# EAGLE design Pop-Up 5.1 (EAGLE 7.2.0)
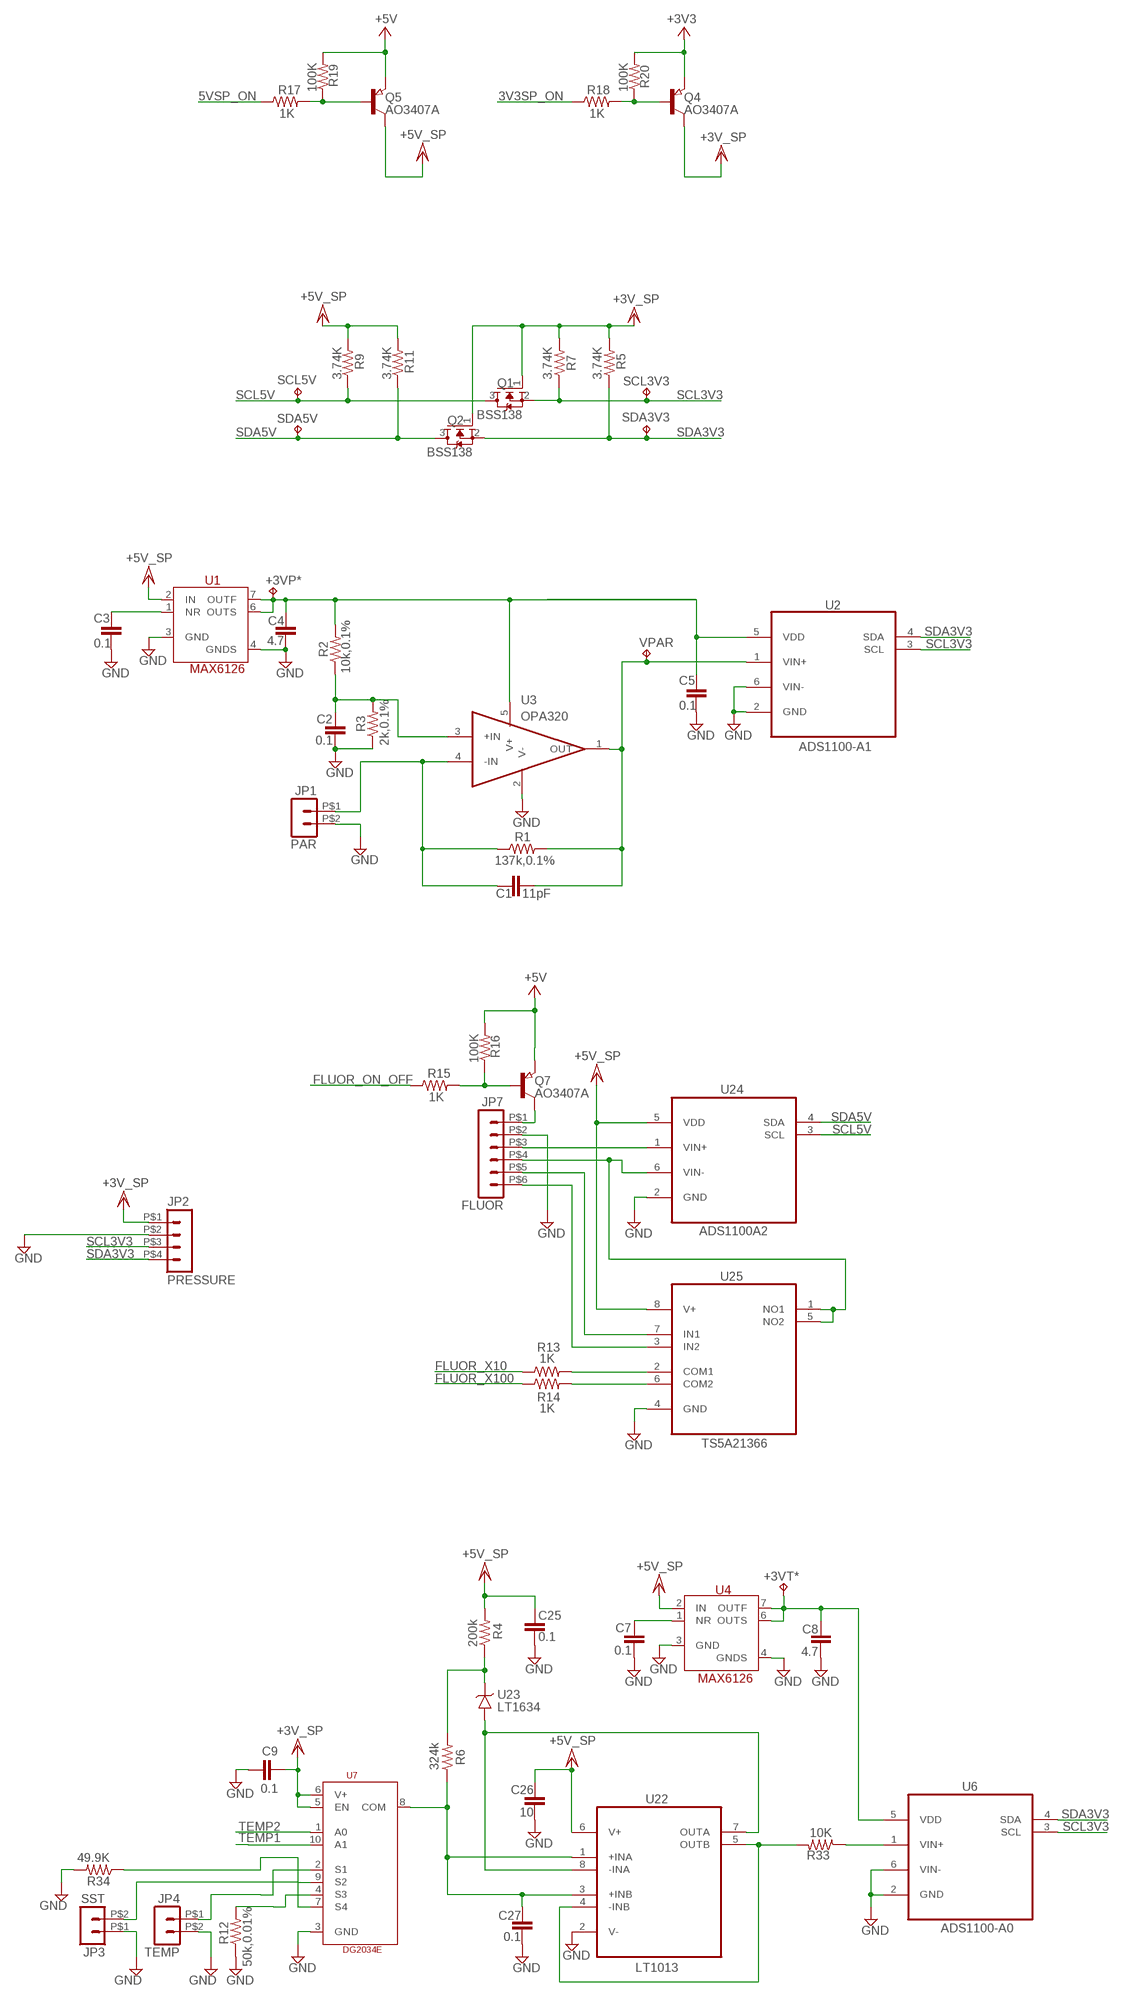
[diagram p0: schematic, sheet 1, part 1 of 2]
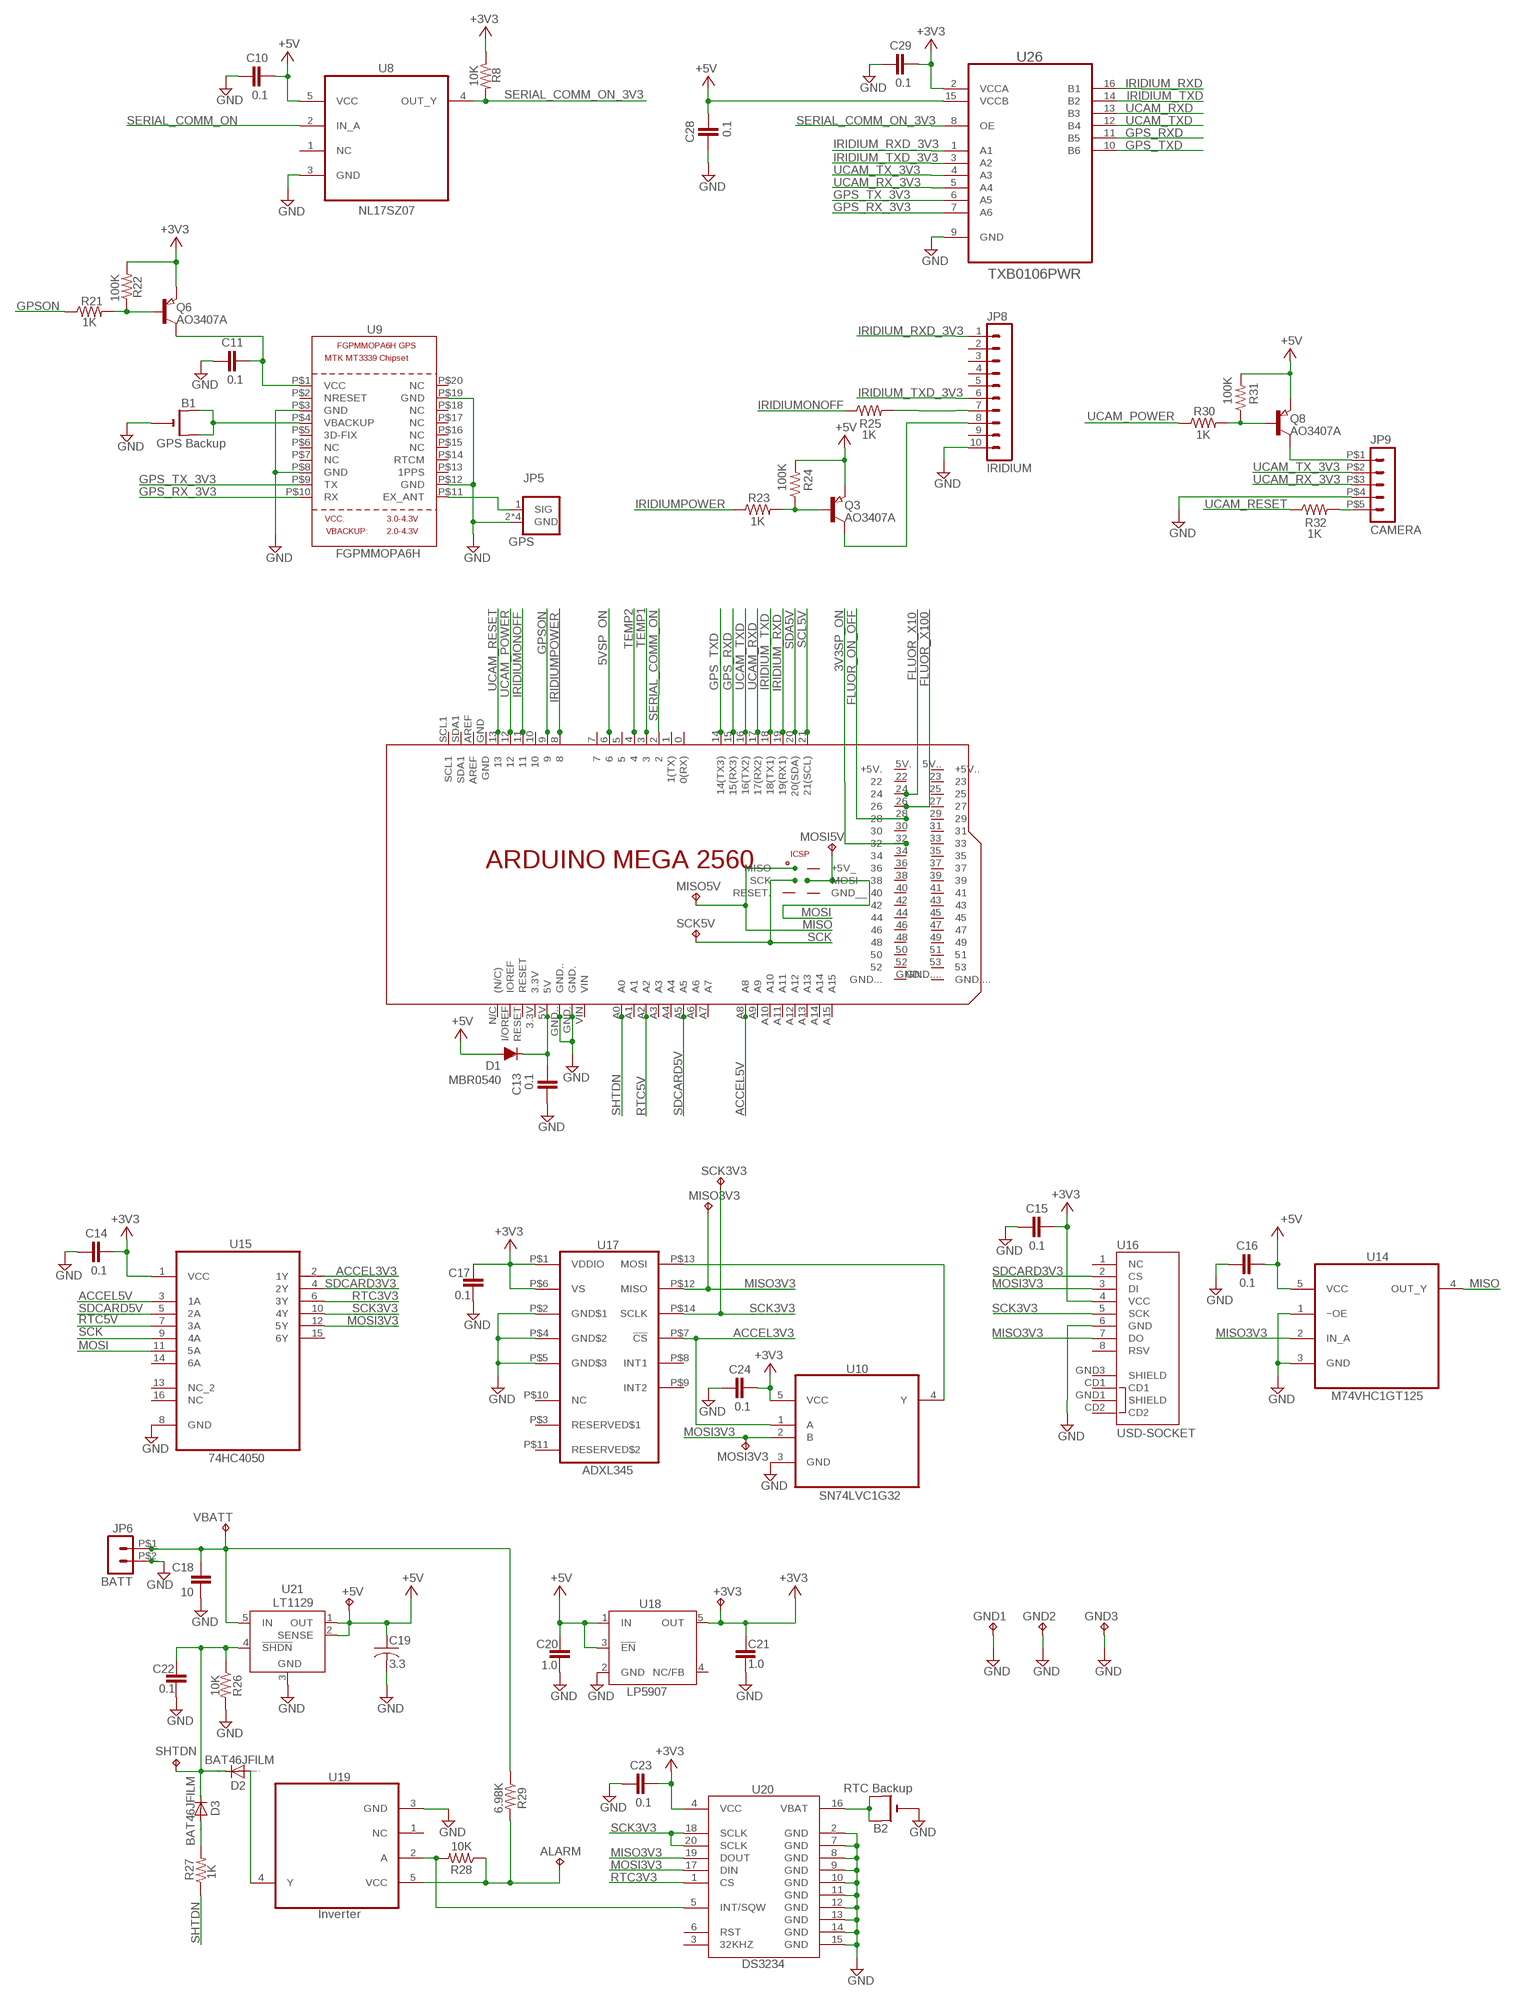
[diagram p1: schematic, sheet 1, part 2 of 2]

## Parts
+3V3  TP-040  [TP-040]
+3VP*  TP-040  [TP-040]
+3VT*  TP-040  [TP-040]
+5V  TP-040  [TP-040]
ALARM  TP-040  [TP-040]
B1  GPS Backup  CR1220SMT  [CR1220-SMD]
B2  RTC Backup  CR1220SMT  [CR1220-SMD]
C1  11pF  CAP0603-CAP  [0603-CAP]
C2  0.1  CAP0603-CAP  [0603-CAP]
C3  0.1  CAP0603-CAP  [0603-CAP]
C4  4.7  CAP0603-CAP  [0603-CAP]
C5  0.1  CAP0603-CAP  [0603-CAP]
C7  0.1  CAP0603-CAP  [0603-CAP]
C8  4.7  CAP0603-CAP  [0603-CAP]
C9  0.1  CAP0603-CAP  [0603-CAP]
C10  0.1  CAP0603-CAP  [0603-CAP]
C11  0.1  CAP0603-CAP  [0603-CAP]
C13  0.1  CAP0603-CAP  [0603-CAP]
C14  0.1  CAP0603-CAP  [0603-CAP]
C15  0.1  CAP0603-CAP  [0603-CAP]
C16  0.1  CAP0603-CAP  [0603-CAP]
C17  0.1  CAP0603-CAP  [0603-CAP]
C18  10  C-EUC1206  [C1206]
C19  3.3  C-USC1206  [C1206]
C20  1.0  CAP0603-CAP  [0603-CAP]
C21  1.0  CAP0603-CAP  [0603-CAP]
C22  0.1  CAP0603-CAP  [0603-CAP]
C23  0.1  CAP0603-CAP  [0603-CAP]
C24  0.1  CAP0603-CAP  [0603-CAP]
C25  0.1  CAP0603-CAP  [0603-CAP]
C26  10  C-EUC1206  [C1206]
C27  0.1  CAP0603-CAP  [0603-CAP]
C28  0.1  CAP0603-CAP  [0603-CAP]
C29  0.1  CAP0603-CAP  [0603-CAP]
D1  MBR0540  D-FILL-SOD123  [SOD123]
D2  BAT46JFILM  DIODE-SOD323-R  [SOD323-R]
D3  BAT46JFILM  DIODE-SOD323-R  [SOD323-R]
GND1  TP-040  [TP-040]
GND2  TP-040  [TP-040]
GND3  TP-040  [TP-040]
JP1  PAR  HEADER_POS2_43650-0215  [43650-0215]
JP2  PRESSURE  HEADER_POS4_43650-0415  [43650-0415]
JP3  SST  HEADER_POS2_43650-0215  [43650-0215]
JP4  TEMP  HEADER_POS2_43650-0215  [43650-0215]
JP5  GPS  901-9895-RFX  [AMPHENOL_901-9895-RFX]
JP6  BATT  HEADER_POS2_43650-0215  [43650-0215]
JP7  FLUOR  HEADER_POS6_43045-0612  [43045-0612]
JP8  IRIDIUM  53398-1010  [53398-1010]
JP9  CAMERA  HEADER_POS5_43650-0515  [43650-0515]
MISO3V3  TP-040  [TP-040]
MISO5V  TP-040  [TP-040]
MOSI3V3  TP-040  [TP-040]
MOSI5V  TP-040  [TP-040]
Q1  BSS138  MOSFET-NREFLOW  [SOT23]
Q2  BSS138  MOSFET-NREFLOW  [SOT23]
Q3  AO3407A  PNP-TRANSISTOR_SOT23  [SOT23]
Q4  AO3407A  PNP-TRANSISTOR_SOT23  [SOT23]
Q5  AO3407A  PNP-TRANSISTOR_SOT23  [SOT23]
Q6  AO3407A  PNP-TRANSISTOR_SOT23  [SOT23]
Q7  AO3407A  PNP-TRANSISTOR_SOT23  [SOT23]
Q8  AO3407A  PNP-TRANSISTOR_SOT23  [SOT23]
R1  137k,0.1%  R-US_R0603  [R0603]
R2  10k,0.1%  R-US_R0603  [R0603]
R3  2k,0.1%  R-US_R0603  [R0603]
R4  200k  R-US_R1206  [R1206]
R5  3.74K  R-US_R0603  [R0603]
R6  324k  R-US_R1206  [R1206]
R7  3.74K  R-US_R0603  [R0603]
R8  10K  R-US_R0603  [R0603]
R9  3.74K  R-US_R0603  [R0603]
R11  3.74K  R-US_R0603  [R0603]
R12  50k,0.01%  R-US_R2010  [R2010]
R13  1K  R-US_R0603  [R0603]
R14  1K  R-US_R0603  [R0603]
R15  1K  R-US_R0603  [R0603]
R16  100K  R-US_R0603  [R0603]
R17  1K  R-US_R0603  [R0603]
R18  1K  R-US_R0603  [R0603]
R19  100K  R-US_R0603  [R0603]
R20  100K  R-US_R0603  [R0603]
R21  1K  R-US_R0603  [R0603]
R22  100K  R-US_R0603  [R0603]
R23  1K  R-US_R0603  [R0603]
R24  100K  R-US_R0603  [R0603]
R25  1K  R-US_R0603  [R0603]
R26  10K  R-US_R0603  [R0603]
R27  1K  R-US_R0603  [R0603]
R28  10K  R-US_R0603  [R0603]
R29  6.98K  R-US_R0603  [R0603]
R30  1K  R-US_R0603  [R0603]
R31  100K  R-US_R0603  [R0603]
R32  1K  R-US_R0603  [R0603]
R33  10K  R-US_R0603  [R0603]
R34  49.9K  R-US_R0603  [R0603]
SCK3V3  TP-040  [TP-040]
SCK5V  TP-040  [TP-040]
SCL3V3  TP-040  [TP-040]
SCL5V  TP-040  [TP-040]
SDA3V3  TP-040  [TP-040]
SDA5V  TP-040  [TP-040]
SHTDN  TP-040  [TP-040]
U1  MAX6126  [SOIC127P600X175-8N]
U2  ADS1100-A1  ADS1100A0IDBVT  [SOT95P280X145-6N]
U3  OPA320  OPA320AIDBVT  [SOT95P280X145-5N]
U4  MAX6126  [SOIC127P600X175-8N]
U6  ADS1100-A0  ADS1100A0IDBVT  [SOT95P280X145-6N]
U7  DG2034E  [MSOP10]
U8  NL17SZ07  NL17SZ07DFT2G  [SOT65P210X110-5N]
U9  FGPMMOPA6H  GPS_FGPMMOPA6H  [FGPMMOPA6H]
U10  SN74LVC1G32  SN74LVC1G32DCKT  [SOT65P210X110-5N]
U12  Arduino MEGA2650  MEGA2650_UPSIDEDOWNMOUNT  [MEGA2650_UPSIDEDOWNMOUNT]
U14  M74VHC1GT125  M74VHC1GT125DF1G  [SOT65P210X110-5N]
U15  74HC4050  M74HC4050RM13TR  [SOIC127P600X175-16N]
U16  USD-SOCKET  [MICROSD_1:1]
U17  ADXL345  [LGA14]
U18  LP5907  TPS77033  [SOT23-DBV]
U19  Inverter  1P1G14MDBVREPG4  [SOT95P280X145-5N]
U20  DS3234  [DS3234]
U21  LT1129  LT1129CQ-5  [Q5-DD]
U22  LT1013  LT1013IS8PBF  [SOIC127P600X175-8N]
U23  LT1634  LT1634BIS8-1.25  [S8]
U24  ADS1100A2  ADS1100A2IDBVT  [SOT95P280X145-6N]
U25  TS5A21366  TS5A21366DCUR  [SOP50P310X90-8N]
U26  TXB0106PWR  [SOP65P640X120-16N]
VBATT  TP-040  [TP-040]
VPAR  TP-040  [TP-040]

## Nets
3V3SP_ON: R18.1 U12.32
5VSP_ON: R17.1 U12.6
+3V3: +3V3.1 C14.1 C15.1 C17.1 C21.1 C23.1 C24.1 C29.1 Q4.2(E) Q6.2(E) R8.1 R20.2 R22.2 U10.5(VCC) U15.1(VCC) U16.4(VCC) U17.P$1(VDDIO) U17.P$6(VS) U18.5(OUT) U20.4(VCC) U26.2(VCCA)
+5V: +5V.1 C10.1 C16.1 C19.1 C20.1 C28.1 D1.2(A) Q3.2(E) Q5.2(E) Q7.2(E) Q8.2(E) R16.2 R19.2 R24.2 R31.2 U8.5(VCC) U14.5(VCC) U18.1(IN) U18.3(!EN) U21.1(OUT) U21.2(SENSE) U26.15(VCCB)
ACCEL3V3: U10.1(A) U15.2(1Y) U17.P$7(!CS)
ACCEL5V: U12.A8 U15.3(1A)
FLUOR_ON_OFF: R15.1 U12.28
FLUOR_X10: R13.1 U12.24
FLUOR_X100: R14.1 U12.26
GND: B1.- B2.- C2.2 C3.2 C4.2 C5.1 C7.2 C8.2 C9.2 C10.2 C11.2 C13.2 C14.2 C15.2 C16.2 C17.2 C18.2 C19.2 C20.2 C21.2 C22.2 C23.2 C24.2 C25.2 C26.2 C27.2 C28.2 C29.2 GND1.1 GND2.1 GND3.1 JP1.P$2 JP2.P$2 JP3.P$1 JP4.P$2 JP5.2(GND) JP5.3(GND) JP5.4(GND) JP5.5(GND) JP6.P$2 JP7.P$2 JP8.10 JP9.P$4 R3.1 R12.1 R26.2 R34.2 U1.3(GND) U1.4(GNDS) U2.2(GND) U2.6(VIN-) U3.2(V-) U4.3(GND) U4.4(GNDS) U6.2(GND) U6.6(VIN-) U7.3(GND) U8.3(GND) U9.P$3(GND) U9.P$8(GND) U9.P$12(GND) U9.P$19(GND) U10.3(GND) U12.GND. U12.GND.. U14.1(~OE) U14.3(GND) U15.8(GND) U16.6(GND) U17.P$2(GND$1) U17.P$4(GND$2) U17.P$5(GND$3) U18.2(GND) U19.3(GND) U20.2(GND) U20.7(GND) U20.8(GND) U20.9(GND) U20.10(GND) U20.11(GND) U20.12(GND) U20.13(GND) U20.14(GND) U20.15(GND) U21.3(GND) U22.2(V-) U24.2(GND) U25.4(GND) U26.9(GND)
GPS_RX_3V3: U9.P$10(RX) U26.7(A6)
GPS_RXD: U12.15(15(RX3)) U26.11(B5)
GPS_TX_3V3: U9.P$9(TX) U26.6(A5)
GPS_TXD: U12.14(14(TX3)) U26.10(B6)
GPSON: R21.1 U12.9
IRIDIUM_RXD: U12.19(19(RX1)) U26.16(B1)
IRIDIUM_RXD_3V3: JP8.1 U26.1(A1)
IRIDIUM_TXD: U12.18(18(TX1)) U26.14(B2)
IRIDIUM_TXD_3V3: JP8.6 U26.3(A2)
IRIDIUMONOFF: R25.1 U12.11
IRIDIUMPOWER: R23.1 U12.8
MISO: MISO5V.1 U12.MISO U14.4(OUT_Y)
MISO3V3: MISO3V3.1 U14.2(IN_A) U16.7(DO) U17.P$12(MISO) U20.19(DOUT)
MOSI: MOSI5V.1 U12.MOSI U15.11(5A)
MOSI3V3: MOSI3V3.1 U10.2(B) U15.12(5Y) U16.3(DI) U20.17(DIN)
N$1: D2.A U19.4(Y)
N$2: Q3.1(B) R23.2 R24.1
N$3: ALARM.1 R28.1 R29.2 U19.5(VCC)
N$4: JP8.7 R25.2
N$5: C7.1 U4.1(NR)
N$6: C13.1 D1.1(C) U12.5V
N$7: JP4.P$1 U7.2(S1)
N$9: JP8.8 Q3.3(C)
N$10: JP5.1(SIG) U9.P$11(EX_ANT)
N$11: +3VT*.1 C8.1 U4.6(OUTS) U4.7(OUTF) U6.5(VDD)
N$12: R4.1 R6.2 U23.6(VOUT)
N$13: U22.7(OUTA) U22.8(-INA) U23.4(GND)
N$14: B1.+$1(+) B1.+$2(+1) U9.P$4(VBACKUP)
N$15: Q6.1(B) R21.2 R22.1
N$16: B2.+$1(+) B2.+$2(+1) U20.16(VBAT)
N$17: R28.2 U19.2(A) U20.5(INT/SQW)
N$18: R33.2 U22.4(-INB) U22.5(OUTB)
N$19: C11.1 Q6.3(C) U9.P$1(VCC)
N$20: JP7.P$3 U24.1(VIN+)
N$21: R13.2 U25.2(COM1)
N$22: JP7.P$5 U25.7(IN1)
N$23: +3VP*.1 C4.1 C5.2 R2.2 U1.6(OUTS) U1.7(OUTF) U2.5(VDD) U3.5(V+)
N$24: C3.1 U1.1(NR)
N$25: C1.2 R1.2 U2.1(VIN+) U3.1(OUT) VPAR.1
N$26: R12.2 U7.4(S3)
N$28: C2.1 R2.1 R3.2 U3.3(+IN)
N$29: JP7.P$6 U25.3(IN2)
N$30: C1.1 JP1.P$1 R1.1 U3.4(-IN)
N$31: C22.1 D2.C D3.C R26.1 SHTDN.1 U21.4(!SHDN)
N$32: Q5.1(B) R17.2 R19.1
N$33: Q4.1(B) R18.2 R20.1
N$34: R14.2 U25.6(COM2)
N$35: U10.4(Y) U17.P$13(MOSI)
N$36: C27.1 R6.1 U7.8(COM) U22.1(+INA) U22.3(+INB)
N$37: Q7.1(B) R15.2 R16.1
N$38: JP7.P$4 U24.6(VIN-) U25.1(NO1) U25.5(NO2)
N$39: Q8.1(B) R30.2 R31.1
N$40: JP7.P$1 Q7.3(C)
N$41: JP9.P$1 Q8.3(C)
N$42: R33.1 U6.1(VIN+)
N$43: JP9.P$5 R32.2
N$44: D3.A R27.2
N$45: JP3.P$2 U7.9(S2)
N$47: R34.1 U7.7(S4)
RTC3V3: U15.6(3Y) U20.1(CS)
RTC5V: U12.A2 U15.7(3A)
SCK: SCK5V.1 U12.SCK U15.9(4A)
SCK3V3: SCK3V3.1 U15.10(4Y) U16.5(SCK) U17.P$14(SCLK) U20.18(SCLK) U20.20(SCLK)
SCL3V3: JP2.P$3 Q1.2(S) R7.1 SCL3V3.1 U2.3(SCL) U6.3(SCL)
SCL5V: Q1.3(D) R9.1 SCL5V.1 U12.21(21(SCL)) U24.3(SCL)
SDA3V3: JP2.P$4 Q2.2(S) R5.1 SDA3V3.1 U2.4(SDA) U6.4(SDA)
SDA5V: Q2.3(D) R11.1 SDA5V.1 U12.20(20(SDA)) U24.4(SDA)
SDCARD3V3: U15.4(2Y) U16.2(CS)
SDCARD5V: U12.A5 U15.5(2A)
SERIAL_COMM_ON: U8.2(IN_A) U12.2
SERIAL_COMM_ON_3V3: R8.2 U8.4(OUT_Y) U26.8(OE)
SHTDN: R27.1 U12.A0
TEMP1: U7.10(A1) U12.3
TEMP2: U7.1(A0) U12.4
UCAM_POWER: R30.1 U12.12
UCAM_RESET: R32.1 U12.13
UCAM_RX_3V3: JP9.P$3 U26.5(A4)
UCAM_RXD: U12.17(17(RX2)) U26.13(B3)
UCAM_TX_3V3: JP9.P$2 U26.4(A3)
UCAM_TXD: U12.16(16(TX2)) U26.12(B4)
VBATT: C18.1 JP6.P$1 R29.1 U21.5(IN) VBATT.1
VCC/2: C25.1 C26.1 Q5.3(C) R4.2 R9.2 R11.2 U1.2(IN) U4.2(IN) U22.6(V+) U24.5(VDD) U25.8(V+) ; supply symbol labelled +5V_SP
VDD: C9.1 JP2.P$1 Q1.1(G) Q2.1(G) Q4.3(C) R5.2 R7.2 U7.5(EN) U7.6(V+) ; supply symbol labelled +3V_SP
Unconnected: JP8.2 JP8.3 JP8.4 JP8.5 JP8.9 U8.1(NC) U9.P$2(NRESET) U9.P$5(3D-FIX) U9.P$6(NC) U9.P$7(NC) U9.P$13(1PPS) U9.P$14(RTCM) U9.P$15(NC) U9.P$16(NC) U9.P$17(NC) U9.P$18(NC) U9.P$20(NC) U12.0(0(RX)) U12.1(1(TX)) U12.3.3V U12.5 U12.5V.(+5V.) U12.5V..(+5V..) U12.7 U12.10 U12.22 U12.23 U12.25 U12.27 U12.29 U12.30 U12.31 U12.33 U12.34 U12.35 U12.36 U12.37 U12.38 U12.39 U12.40 U12.41 U12.42 U12.43 U12.44 U12.45 U12.46 U12.47 U12.48 U12.49 U12.50 U12.51 U12.52 U12.53 U12.+5V_ U12.A1 U12.A3 U12.A4 U12.A6 U12.A7 U12.A9 U12.A10 U12.A11 U12.A12 U12.A13 U12.A14 U12.A15 U12.AREF U12.GND U12.GND... U12.GND.... U12.GND__ U12.I/OREF(IOREF) U12.N/C((N/C)) U12.RESET U12.RESET. U12.SCL1 U12.SDA1 U12.VIN U15.13(NC_2) U15.14(6A) U15.15(6Y) U15.16(NC) U16.1(NC) U16.8(RSV) U16.CD1 U16.CD2 U16.GND1(SHIELD) U16.GND3(SHIELD) U17.P$3(RESERVED$1) U17.P$8(INT1) U17.P$9(INT2) U17.P$10(NC) U17.P$11(RESERVED$2) U18.4(NC/FB) U19.1(NC) U20.3(32KHZ) U20.6(RST)

## Library data of the parts
+3V3 +3VP* +3VT* +5V ALARM GND1-GND3 MISO3V3 MISO5V MOSI3V3 MOSI5V SCK3V3 SCK5V SCL3V3 SCL5V SDA3V3 SDA5V SHTDN VBATT VPAR = keystone:TP: TEST POINT PCB Vertical Mount; OC_NEWARK: unknown
B1 B2 = adafruit:CR1220: CR1216/CR1220/CR1225 12mm 3V lithium coin cell Great for battery packup. Both SMT and THM holders. Note the THM package has the ground pads on both sides of the PCB so that the masks are the same - this reduces the cost
C1-C5 C7-C11 C13-C17 C20-C25 C27-C29 = SparkFun-Capacitors:CAP: Capacitor Standard 0603 ceramic capacitor, and 0.1" leaded capacitor.; MPN: 2222 370 21104; OC_NEWARK: 98K6987
C18 = rcl:C-EU: CAPACITOR, European symbol
C19 = rcl:C-US: CAPACITOR, American symbol
C26 = rcl:C-EU: CAPACITOR, European symbol; MPN: 2222 370 21104; OC_NEWARK: 98K6987
D1 = semicon-smd-ipc:D-FILL-: DIODE filled
D2 D3 = diode:DIODE-: DIODE; OC_NEWARK: unknown
JP1 JP3 JP4 JP6 = con-molex-micro-fit-3_0:HEADER_POS2_?: Molex - Micro-Fit 3.0 Series connector, 3.00mm (0.118") pitch header, 2 positions.
JP2 = con-molex-micro-fit-3_0:HEADER_POS4_?: Molex - Micro-Fit 3.0 Series connector, 3.00mm (0.118") pitch header, 4 positions.
JP5 = Amphenol_By_element14_Batch_1:901-9895-RFX: RF/COAXIAL, SMA JACK, STR, 50OHM, SOLDER; MPN: 901-9895-RFX; OC_FARNELL: -; OC_NEWARK: 83F6735; PACKAGE: RF/COAXIAL, SMA JACK, STR, 50OHM, SOLDER; SUPPLIER: Amphenol
JP7 = con-molex-micro-fit-3_0:HEADER_POS6_?: Molex - Micro-Fit 3.0 Series connector, 3.00mm (0.118") pitch header, 6 positions.
JP8 = con-molex-picoblade:53398-1010: HEADER
JP9 = con-molex-micro-fit-3_0:HEADER_POS5_?: Molex - Micro-Fit 3.0 Series connector, 3.00mm (0.118") pitch header, 5 positions.
Q1 Q2 = adafruit:MOSFET-N: N-Channel Mosfet 2N7002E - 60V 260mA SOT23 [Digikey: 2N7002ET1GOSTR-ND] - REEL BSH103 - 30V 850mA SOT23 [Digikey: 568-5013-1-ND]
Q3-Q8 = semicon-smd-ipc:PNP-TRANSISTOR_: PNP TRANSISTOR
R1-R9 R11 R13-R34 = resistor:R-US_: RESISTOR, American symbol; OC_NEWARK: unknown
R12 = resistor:R-US_: RESISTOR, American symbol
U1 U4 = Maxim_By_element14_Batch_1:MAX6126
U2 U6 = Texas Instruments_By_element14_Batch_1:ADS1100A0IDBVT: Self-Calibrating, 16-Bit ANALOG-TO-DIGITAL CONVERTER; MPN: ADS1100A0IDBVT; OC_FARNELL: 1135959; OC_NEWARK: 20H0708; PACKAGE: SOT-23-6; SUPPLIER: Texas Instruments
U3 = Texas Instruments_By_element14_Batch_1:OPA320AIDBVT: Operational Amplifier; MPN: OPA320AIDBVT; OC_FARNELL: 2057093; OC_NEWARK: 64T3764; PACKAGE: SOT-23-5; SUPPLIER: Texas Instruments
U7 = adafruit:DG2034E
U8 = ON Semiconductor_By_element14_Batch_1:NL17SZ07DFT2G: Single Non-Inverting Buffer with Open Drain Output; MPN: NL17SZ07DFT2G; OC_FARNELL: 1705431; OC_NEWARK: 04R7799; PACKAGE: SOT-353-5; SUPPLIER: ON Semiconductor
U9 = adafruit:GPS_FGPMMOPA6H: GPS Module - MTK MT3339 Chipset, -165dBm sensitivity, 22 channels, 10Hz, auto-select external antenna options
U10 = Texas Instruments_By_element14_Batch_1:SN74LVC1G32DCKT: SINGLE 2-INPUT POSITIVE-OR GATE; MPN: SN74LVC1G32DCKT; OC_FARNELL: 1236340; OC_NEWARK: 22H0383; PACKAGE: SC70-5; SUPPLIER: Texas Instruments
U12 = E14_Arduino_revB:MEGA2650_UPSIDEDOWNMOUNT
U14 = ON Semiconductor_By_element14_Batch_1:M74VHC1GT125DF1G: Noninverting Buffer / CMOS Logic Level Shifter; MPN: M74VHC1GT125DF1G; OC_FARNELL: 1567363; OC_NEWARK: 83H7591; PACKAGE: SOT-23-5; SUPPLIER: ON SEMICONDUCTOR
U15 = ST Microelctronics_By_element14_Batch_1:M74HC4050RM13TR: HEX BUFFER/CONVERTER; MPN: M74HC4050RM13TR; OC_FARNELL: 1261257; OC_NEWARK: 89K0905; PACKAGE: SOIC-16; SUPPLIER: STMICROELECTRONICS
U16 = SparkFun-Connectors:USD-SOCKET: microSD Socket Push-push type uSD socket. Schematic element and footprint production proven. Spark Fun Electronics SKU : PRT-00127. tDoc lines correctly indicate media card edge positions when inserting (unlocked, locked, depressed). NOTE: CD1 and CD2 are connected internally; PROD_ID: CONN-07820
U17 = adxl345:ADXL345: 3-Axis, ±2 g/±4 g/±8 g/±16 g Digital Accelerometer
U18 = texas:TPS770*: ULTRALOW-POWER 50-mA LOW-DROPOUT LINEAR REGULATORS 50-mA Low-Dropout Regulator Source: http://focus.ti.com/lit/ds/symlink/tps77001.pdf; MF: TEXAS INSTRUMENTS; MPN: TPS77033DBVT; OC_FARNELL: 8461570; OC_NEWARK: 77C1187
U19 = Texas Instruments_By_element14_Batch_1:1P1G14MDBVREPG4: SINGLE SCHMITT-TRIGGER INVERTER; MPN: 1P1G14MDBVREPG4; OC_FARNELL: -; OC_NEWARK: unknown; PACKAGE: SOT-23-5; SUPPLIER: Texas Instruments
U20 = SparkFun-FreqCtrl:DS3234: SPI RTC module with battery backup and internal clock.
U21 = linear-technology:LT1129CQ-5: VOLTAGE REGULATOR with shutdown; MPN: LT1129CQ-5#PBF; OC_FARNELL: 1663373; OC_NEWARK: 57M2058
U22 = LTC_By_element14_Batch_1:LT1013IS8PBF: Dual Precision Op Amp; MPN: LT1013IS8#PBF; OC_FARNELL: 1556424; OC_NEWARK: 57M0833; PACKAGE: SOIC-8; SUPPLIER: Linear Technology
U23 = linear-technology:LT1634: Micropower Precision Shunt Voltage Reference Source: Darta sheet <http://cds.linear.com/docs/en/datasheet/1634fe.pdf>
U24 = Texas Instruments_By_element14_Batch_1:ADS1100A2IDBVT: Self-Calibrating, 16-Bit ANALOG-TO-DIGITAL CONVERTER; MPN: ADS1100A2IDBVT; OC_FARNELL: 1206858; OC_NEWARK: 20H0712; PACKAGE: SOT-23-6; SUPPLIER: Texas Instruments
U25 = Texas Instruments_By_element14_Batch_1:TS5A21366DCUR: 0.75-Ù DUAL SPST ANALOG SWITCH WITH 1.8-V COMPATIBLE INPUT LOGIC; MPN: TS5A21366DCUR; OC_FARNELL: 1710838; OC_NEWARK: 04R6571; PACKAGE: SOP-8; SUPPLIER: Texas Instruments
U26 = Texas Instruments_By_element14_Batch_1:TXB0106PWR: VOLTAGE-LEVEL TRANSLATOR; MPN: TXB0106PWR; OC_FARNELL: 1694679; OC_NEWARK: 46P3786; PACKAGE: TSSOP-16; SUPPLIER: Texas Instruments

## Board
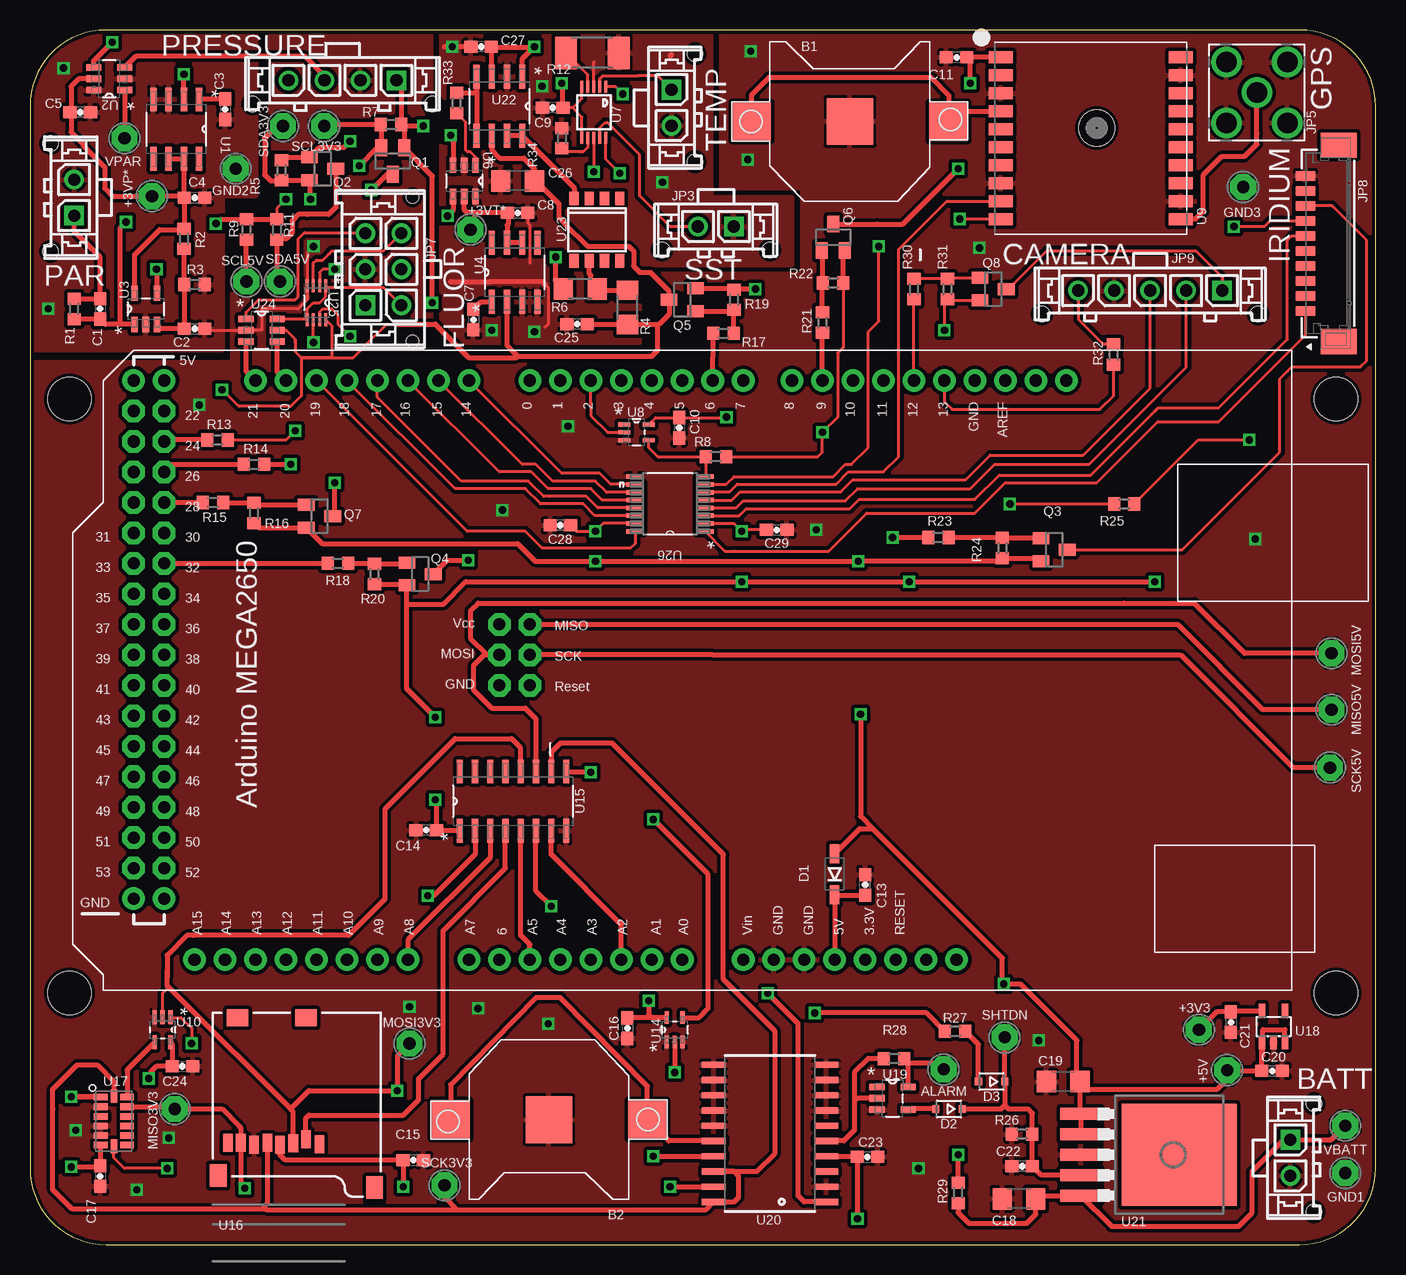
[diagram p2: board, top side]
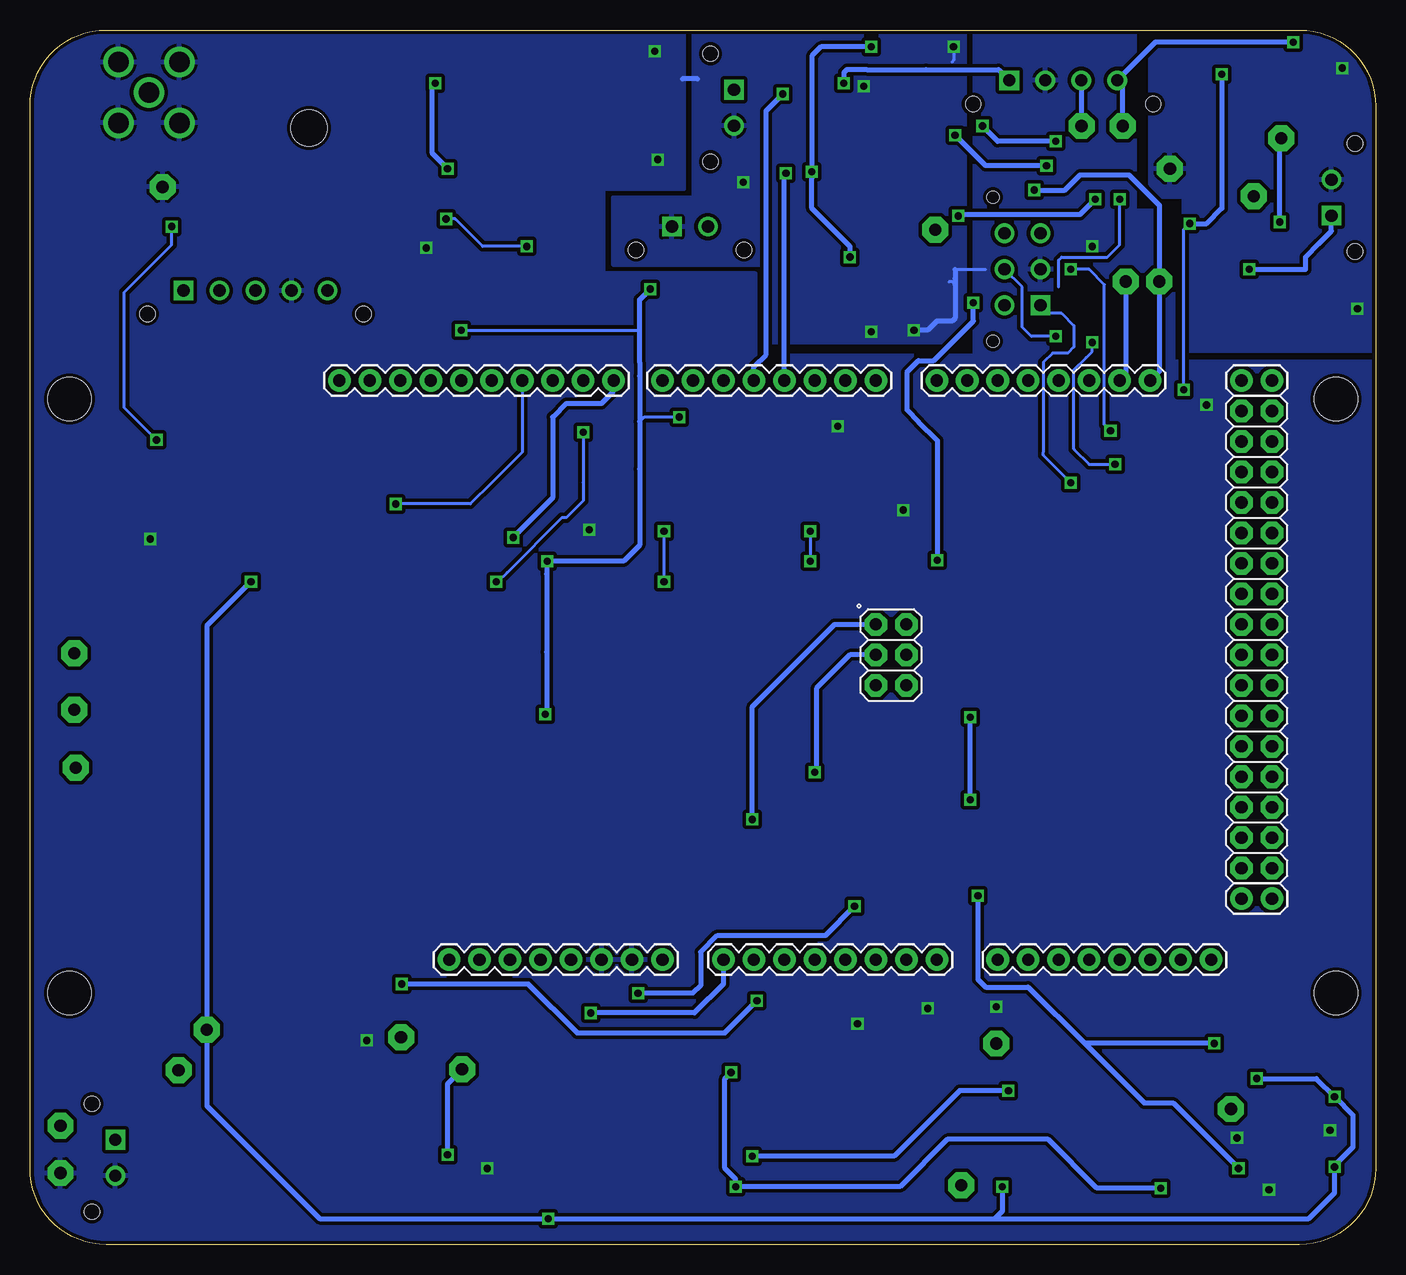
[diagram p3: board, bottom side, seen from below]

Size 112.14 x 101.22 mm. Coordinates in mm from the lower left corner, seen from the top.
Outline: 105.79,101.22 6.35,101.22 arc90 0,94.87 0,6.35 arc90 6.35,0 105.79,0 arc90 112.14,6.35 112.14,94.87 arc90 105.79,101.22
Copper layers (1*16): Top 0.035mm / dielectric 1.5mm / Bottom 0.035mm
Design rules "default *": minimum track width 10mil, minimum drill 20mil, track to track 10mil, track to pad 6mil, pad to pad 6mil, via to via 10mil, smd to smd 6mil, copper to edge 12mil, drill to drill 12mil, minimum pad ring 12mil, minimum via ring 8mil, stop-mask expansion 4mil, vias tented up to drill 0mil, thermal gap 10mil
Holes 3.61 mm at 108.84,70.48 108.84,20.95 3.3,20.95 3.3,70.48

### Footprints (pad centres in the part's own frame; a part is rotated, then mirrored left to right if it is on the bottom)
TP-040 = drill 1.016 pad 2.159 octagon: 1 0,0
CR1220-SMD = smd 3.2 x 3.2: +$1 -8.2,0; +$2 8.2,0 | smd 3.9 x 3.9: - 0,0
0603-CAP = smd 1.1 x 1: 1 -0.85,0; 2 0.85,0
C1206 = smd 1.6 x 1.8: 1 -1.4,0; 2 1.4,0
SOD123 = smd 1.6 x 0.8: 1 -1.7,0; 2 1.7,0
SOD323-R = smd 0.6 x 0.6: A 1.1,0; C -1.1,0
43650-0215 = drill 1.02 square: P$1 1.5,0 | drill 1.02: P$2 -1.5,0 | hole 1.27: 4.5,-1.96; -4.5,-1.96
43650-0415 = drill 1.02 square: P$1 4.5,0 | drill 1.02: P$2 1.5,0; P$3 -1.5,0; P$4 -4.5,0 | hole 1.27: 7.5,-1.96; -7.5,-1.96
AMPHENOL_901-9895-RFX = drill 1.702: 1 0,0; 2 -2.54,2.54; 3 -2.54,-2.54; 4 2.54,-2.54; 5 2.54,2.54
43045-0612 = drill 1.02 square: P$1 3,0 | drill 1.02: P$2 0,0; P$3 -3,0; P$4 3,3; P$5 0,3; P$6 -3,3 | hole 1.02: 6,3.94; -6,3.94
53398-1010 = smd 0.8 x 1.6: 1 5.625,0; 2 4.375,0; 3 3.125,0; 4 1.875,0; 5 0.625,0; 6 -0.625,0; 7 -1.875,0; 8 -3.125,0; 9 -4.375,0; 10 -5.625,0 | smd 2.1 x 3: M1 8.185,2.75; M2 -8.185,2.75
43650-0515 = drill 1.02 square: P$1 6,0 | drill 1.02: P$2 3,0; P$3 0,0; P$4 -3,0; P$5 -6,0 | hole 1.27: 9,-1.96; -9,-1.96
SOT23 = smd 1 x 1.4: 1 -0.95,-1.1; 2 0.95,-1.1; 3 0,1.1
R0603 = smd 1 x 1.1: 1 -0.85,0; 2 0.85,0
R1206 = smd 1.6 x 1.803: 1 -1.422,0; 2 1.422,0
R2010 = smd 1.8 x 2.7: 1 -2.2,0; 2 2.2,0
SOIC127P600X175-8N = smd 1.981 x 0.533: 1 -2.464,1.905; 2 -2.464,0.635; 3 -2.464,-0.635; 4 -2.464,-1.905; 5 2.464,-1.905; 6 2.464,-0.635; 7 2.464,0.635; 8 2.464,1.905
SOT95P280X145-6N = smd 1.27 x 0.559: 1 -1.295,0.94; 2 -1.295,0; 3 -1.295,-0.94; 4 1.295,-0.94; 5 1.295,0; 6 1.295,0.94
SOT95P280X145-5N = smd 1.27 x 0.559: 1 -1.295,0.94; 2 -1.295,0; 3 -1.295,-0.94; 4 1.295,-0.94; 5 1.295,0.94
MSOP10 = smd 0.25 x 1: 1 -1,-2.113; 2 -0.5,-2.113; 3 0,-2.113; 4 0.5,-2.113; 5 1,-2.113; 6 1,2.113; 7 0.5,2.113; 8 0,2.113; 9 -0.5,2.113; 10 -1,2.113
SOT65P210X110-5N = smd 1.016 x 0.356: 1 -1.016,0.66; 2 -1.016,0; 3 -1.016,-0.66; 4 1.016,-0.66; 5 1.016,0.66
FGPMMOPA6H = smd 2 x 1: P$1 -7.5,6.75; P$2 -7.5,5.25; P$3 -7.5,3.75; P$4 -7.5,2.25; P$5 -7.5,0.75; P$6 -7.5,-0.75; P$7 -7.5,-2.25; P$8 -7.5,-3.75; P$9 -7.5,-5.25; P$10 -7.5,-6.75; P$11 7.5,-6.75; P$12 7.5,-5.25; P$13 7.5,-3.75; P$14 7.5,-2.25; P$15 7.5,-0.75; P$16 7.5,0.75; P$17 7.5,2.25; P$18 7.5,3.75; P$19 7.5,5.25; P$20 7.5,6.75 | hole 3: 0.5,0.85
SOT65P210X110-5N' = smd 1.168 x 0.356: 1 -1.041,0.66; 2 -1.041,0; 3 -1.041,-0.66; 4 1.041,-0.66; 5 1.041,0.66
MEGA2650_UPSIDEDOWNMOUNT = drill 1.016 pad 1.88: 0 27.94,-20.32; 1 25.4,-20.32; 2 22.86,-20.32; 3 20.32,-20.32; 3.3V 0,27.94; 4 17.78,-20.32; 5 15.24,-20.32; 5V 2.54,27.94; 5V. 58.42,-20.32; 5V.. 60.96,-20.32; 6 12.7,-20.32; 7 10.16,-20.32; 8 6.096,-20.32; 9 3.556,-20.32; 10 1.016,-20.32; 11 -1.524,-20.32; 12 -4.064,-20.32; 13 -6.604,-20.32; 14 33.02,-20.32; 15 35.56,-20.32; 16 38.1,-20.32; 17 40.64,-20.32; 18 43.18,-20.32; 19 45.72,-20.32; 20 48.26,-20.32; 21 50.8,-20.32; A0 15.24,27.94; A1 17.78,27.94; A2 20.32,27.94; A3 22.86,27.94; A4 25.4,27.94; A5 27.94,27.94; A6 30.48,27.94; A7 33.02,27.94; A8 38.1,27.94; A9 40.64,27.94; A10 43.18,27.94; A11 45.72,27.94; A12 48.26,27.94; A13 50.8,27.94; A14 53.34,27.94; A15 55.88,27.94; AREF -11.684,-20.32; GND -9.144,-20.32; GND. 7.62,27.94; GND.. 5.08,27.94; GND... 58.42,22.86; GND.... 60.96,22.86; I/OREF -5.08,27.94; N/C -7.62,27.94; RESET -2.54,27.94; SCL1 -16.764,-20.32; SDA1 -14.224,-20.32; VIN 10.16,27.94 | drill 1.016 pad 1.88 octagon: 22 58.42,-17.78; 23 60.96,-17.78; 24 58.42,-15.24; 25 60.96,-15.24; 26 58.42,-12.7; 27 60.96,-12.7; 28 58.42,-10.16; 29 60.96,-10.16; 30 58.42,-7.62; 31 60.96,-7.62; 32 58.42,-5.08; 33 60.96,-5.08; 34 58.42,-2.54; 35 60.96,-2.54; 36 58.42,0; 37 60.96,0; 38 58.42,2.54; 39 60.96,2.54; 40 58.42,5.08; 41 60.96,5.08; 42 58.42,7.62; 43 60.96,7.62; 44 58.42,10.16; 45 60.96,10.16; 46 58.42,12.7; 47 60.96,12.7; 48 58.42,15.24; 49 60.96,15.24; 50 58.42,17.78; 51 60.96,17.78; 52 58.42,20.32; 53 60.96,20.32; +5V_ 30.48,0; GND__ 30.48,5.08; MISO 27.94,0; MOSI 30.48,2.54; RESET. 27.94,5.08; SCK 27.94,2.54
SOIC127P600X175-16N = smd 1.981 x 0.508: 1 -2.464,4.445; 2 -2.464,3.175; 3 -2.464,1.905; 4 -2.464,0.635; 5 -2.464,-0.635; 6 -2.464,-1.905; 7 -2.464,-3.175; 8 -2.464,-4.445; 9 2.464,-4.445; 10 2.464,-3.175; 11 2.464,-1.905; 12 2.464,-0.635; 13 2.464,0.635; 14 2.464,1.905; 15 2.464,3.175; 16 2.464,4.445
MICROSD_1:1 = smd 0.8 x 1.5: 1 5.096,10.919; 2 6.218,10.519; 3 7.274,10.853; 4 8.367,10.982; 5 9.421,10.828; 6 10.539,10.973; 7 11.648,10.819; 8 12.721,10.819 | smd 1.8 x 1.4: CD1 11.92,0.4; CD2 6.22,0.4 | smd 1.4 x 1.9: GND1 0.497,14.55; GND3 13.52,13.55
LGA14 = smd 1.15 x 0.55: P$1 -1.1,2; P$2 -1.1,1.2; P$3 -1.1,0.4; P$4 -1.1,-0.4; P$5 -1.1,-1.2; P$6 -1.1,-2; P$8 1.1,-2; P$9 1.1,-1.2; P$10 1.1,-0.4; P$11 1.1,0.4; P$12 1.1,1.2; P$13 1.1,2 | smd 0.55 x 1.15: P$7 0,-2.1; P$14 0,2.1
SOT23-DBV = smd 0.55 x 1.2: 1 -0.95,-1.3; 2 0,-1.3; 3 0.95,-1.3; 4 0.95,1.3; 5 -0.95,1.3
DS3234 = smd 0.53 x 1.98: 1 -5.715,-4.685; 2 -4.445,-4.685; 3 -3.175,-4.685; 4 -1.905,-4.685; 5 -0.635,-4.685; 6 0.635,-4.685; 7 1.905,-4.685; 8 3.175,-4.685; 9 4.445,-4.685; 10 5.715,-4.685; 11 5.715,4.685; 12 4.445,4.685; 13 3.175,4.685; 14 1.905,4.685; 15 0.635,4.685; 16 -0.635,4.685; 17 -1.905,4.685; 18 -3.175,4.685; 19 -4.445,4.685; 20 -5.715,4.685
Q5-DD = smd 1 x 3.4: 1 -3.4,-7.875; 2 -1.7,-7.875; 3 0,-7.875; 4 1.7,-7.875; 5 3.4,-7.875 | smd 8.5 x 9.6: 6 0,0.325
S8 = smd 0.762 x 1.143: 1 -1.905,-2.6; 2 -0.635,-2.6; 3 0.635,-2.6; 4 1.905,-2.6; 5 1.905,2.6; 6 0.635,2.6; 7 -0.635,2.6; 8 -1.905,2.6
SOP50P310X90-8N = smd 1.067 x 0.254: 1 -1.422,0.762; 2 -1.422,0.254; 3 -1.422,-0.254; 4 -1.422,-0.762; 5 1.422,-0.762; 6 1.422,-0.254; 7 1.422,0.254; 8 1.422,0.762
SOP65P640X120-16N = smd 1.473 x 0.356: 1 -2.921,2.286; 2 -2.921,1.626; 3 -2.921,0.965; 4 -2.921,0.33; 5 -2.921,-0.33; 6 -2.921,-0.965; 7 -2.921,-1.626; 8 -2.921,-2.286; 9 2.921,-2.286; 10 2.921,-1.626; 11 2.921,-0.965; 12 2.921,-0.33; 13 2.921,0.33; 14 2.921,0.965; 15 2.921,1.626; 16 2.921,2.286

### Placement (x,y rotation side)
+3V3  97.41,17.91 180 top
+3VP*  10.16,87.38 0 top
+3VT*  36.7,84.58 90 top
+5V  99.76,14.54 270 top
ALARM  76.14,14.61 0 top
B1  68.33,93.6 0 top
B2  43.24,10.41 180 top
C1  5.84,77.98 270 top
C2  13.72,76.33 0 top
C3  16.26,94.61 270 top
C4  13.72,87.25 0 top
C5  4.19,94.36 180 top
C7  36.96,77.09 270 top
C8  40.64,85.98 0 top
C9  43.56,94.74 180 top
C10  54.1,68.07 270 top
C11  77.22,98.93 180 top
C13  69.6,29.97 90 top
C14  33.02,34.54 180 top
C15  31.94,7.05 0 top
C16  49.78,18.03 270 top
C17  5.84,5.71 270 top
C18  82.42,3.81 180 top
C19  86.11,13.59 180 top
C20  103.5,14.48 0 top
C21  100.08,18.54 270 top
C22  82.68,6.54 180 top
C23  69.79,7.3 0 top
C24  12.7,14.86 0 top
C25  45.59,76.71 180 top
C26  40.64,88.65 180 top
C27  37.59,99.82 180 top
C28  44.2,59.94 180 top
C29  62.23,59.56 0 top
D1  67.06,30.86 90 top
D2  76.58,11.3 180 top
D3  80.14,13.59 180 top
GND1  109.6,5.97 180 top
GND2  17.14,89.66 270 top
GND3  101.09,88.14 90 top
JP1  3.68,87.25 270 top
JP2  26.04,97.03 0 top
JP3  57.15,84.84 0 top
JP4  53.47,94.74 90 top
JP5  102.23,96.01 0 top
JP6  105.03,7.24 90 top
JP7  27.94,81.28 270 top
JP8  106.3,83.44 270 top
JP9  93.34,79.5 0 top
MISO3V3  12.06,11.3 180 top
MISO5V  108.46,44.58 90 top
MOSI3V3  31.62,16.76 180 top
MOSI5V  108.46,49.28 90 top
Q1  30.23,90.3 180 top
Q2  24.38,89.66 270 top
Q3  85.34,57.91 270 top
Q4  32.51,55.88 270 top
Q5  54.36,78.74 90 top
Q6  66.93,83.95 0 top
Q7  24.13,60.71 270 top
Q8  80.26,79.63 270 top
R1  3.68,77.98 270 top
R2  12.83,83.82 90 top
R3  13.72,80.01 180 top
R4  49.78,78.11 270 top
R5  20.95,89.53 90 top
R6  45.85,79.63 0 top
R7  30.1,93.34 0 top
R8  57.15,65.66 180 top
R9  18.03,84.58 90 top
R11  20.57,84.58 90 top
R12  46.86,99.31 180 top
R13  15.62,67.06 0 top
R14  18.67,65.02 0 top
R15  15.24,61.85 0 top
R16  18.67,60.96 270 top
R17  57.78,75.95 0 top
R18  25.65,56.77 0 top
R19  58.67,78.74 90 top
R20  28.7,55.88 270 top
R21  66.04,76.83 90 top
R22  66.93,80.14 0 top
R23  75.69,58.93 0 top
R24  81.03,58.04 270 top
R25  91.19,61.72 0 top
R26  82.68,9.21 180 top
R27  77.09,17.78 0 top
R28  72.01,15.49 180 top
R29  77.34,4.32 90 top
R30  73.66,79.63 90 top
R31  76.45,79.63 270 top
R32  90.3,74.17 90 top
R33  35.56,95.12 90 top
R34  44.32,92.2 90 top
SCK3V3  34.54,4.95 270 top
SCK5V  108.33,39.75 90 top
SCL3V3  24.51,93.22 0 top
SCL5V  18.03,80.26 180 top
SDA3V3  21.08,93.22 0 top
SDA5V  20.83,80.26 180 top
SHTDN  81.22,17.27 180 top
U1  12.19,92.96 270 top
U2  6.6,97.16 180 top
U3  9.65,77.98 90 top
U4  40.39,81.03 90 top
U6  36.2,88.65 270 top
U7  46.99,94.36 180 top
U8  50.55,67.69 0 top
U9  88.39,92.2 0 top
U10  SN74LVC1G32  [SOT65P210X110-5N']  11.05,17.91 270 top
U12  69.6,51.69 180 top
U14  53.72,17.91 90 top
U15  40.26,36.96 90 top
U16  29.21,19.3 180 top
U17  6.99,10.29 0 top
U18  103.63,18.16 0 top
U19  71.88,12.19 0 top
U20  61.66,9.27 90 top
U21  95.44,7.49 270 top
U22  39.12,94.87 270 top
U23  47.24,84.58 180 top
U24  19.3,76.2 0 top
U25  23.88,78.49 270 top
U26  53.34,61.72 180 top
VBATT  109.6,9.91 90 top
VPAR  7.87,92.2 90 top

### Tracks (layer width: path | path; a pad name or v marks a point on that pad's centre or on a via)
3V3SP_ON
  Top 0.406: U12.32 R18.1
5VSP_ON
  Top 0.406: U12.6 R17.1
+3V3  (via drill 0.6)
  Top 0.254: C29.1 59.44,59.56 v59.31,59.44 58.65,60.1 U26.2 | v59.31,55.24 58.93,55.24 | R22.2 67.78,74.76 67.44,74.42 67.31,74.3 67.31,68.96 v66.04,67.69 66.04,67.18 66.04,66.04 65.66,65.66 R8.1 | v73.28,55.24 73.66,55.24
  Top 0.406: U18.5 100.14,19.46 C21.1 98.89,19.39 +3V3.1 | U20.4 68.87,7.37 C23.1 68.94,2.18 v68.96,2.16 | v31.11,4.83 31.09,4.85 C15.1 21.27,7.05 20.83,7.49 20.83,8.31 U16.4 | v3.43,6.48 5.75,6.48 C17.1 5.88,6.61 U17.P$6 5.88,8.17 5.84,8.13 5.84,8.26 | R20.2 31.31,55.03 Q4.2 31.41,53.34 | v9.91,13.84 10.03,13.97 10.03,14.35 10.54,14.86 C24.1 11.85,16.73 U10.5 | U15.1 33.92,34.49 C14.1 33.87,37.08 v33.78,37.08 | v33.78,43.94 31.41,46.31 31.41,53.34 | 31.41,53.34 33.02,53.34 34.42,53.34 36.32,55.24 58.93,55.24 v59.31,55.24 v73.28,55.24 73.66,55.24 v93.73,55.24 | R22.2 67.78,82.75 Q6.2 | U17.P$1 3.46,12.29 v3.43,12.32 5.85,12.32 U17.P$1
  Bottom 0.254: v59.31,59.44 v59.31,55.24 | v66.04,67.69 66.04,63.5 66.04,61.98 67.44,60.58 67.82,60.58 72.39,56.01 73.15,55.24 v73.28,55.24
  Bottom 0.406: 31.75,2.16 v68.96,2.16 88.01,2.16 97.41,11.56 +3V3.1 97.41,51.56 v93.73,55.24 | 31.75,2.16 5.59,2.16 3.43,4.32 v3.43,6.48 3.43,6.6 1.91,8.13 1.91,10.79 v3.43,12.32 4.95,13.84 v9.91,13.84 | v31.11,4.83 31.11,2.79 31.75,2.16 | v33.78,43.94 33.82,43.91 33.82,37.12 v33.78,37.08
+5V  (via drill 0.6)
  Top 0.254: v58.04,68.96 58,68.92 C10.1 52.13,68.92 U8.5 | C28.1 45.55,59.44 v47.12,59.44 47.78,60.1 U26.15 | v47.12,56.96 47.5,56.96 | Q8.2 76.55,78.68 R31.2 76.2,78.53 76.2,77.22 v76.2,76.2
  Top 0.406: 102.66,15.75 C20.1 99.82,14.48 +5V.1 99.76,13.78 98.93,12.95 88.14,12.95 C19.1 | 102.66,15.75 102.66,16.83 U18.1 | U21.2 U21.1 87.51,10.95 C19.1 | U14.5 51.82,18.92 | 51.82,18.92 50.38,18.92 C16.1 | v51.56,20.32 51.56,19.18 51.82,18.92 | 102.66,15.75 102.74,15.75 102.74,17.91 104.58,17.91 U18.3 | Q3.2 84.02,57.19 R24.2 80.99,57.15 80.8,56.96 v69.03,56.96 47.5,56.96 v47.12,56.96 42.1,56.96 40.64,58.42 24.37,58.42 Q7.2 19.02,59.76 R16.2 | C19.1 87.25,13.85 87.25,17.02 82.55,21.72 v81.15,21.72 81.03,21.84 81.03,23.88 71.12,33.78 70.23,34.67 | D1.2 69.17,34.67 70.23,34.67 | v69.22,44.2 69.22,35.69 70.23,34.67 | v60.45,79.63 58.71,79.63 R19.2 58.57,79.69 Q5.2
  Bottom 0.254: v58.04,68.96 60.96,68.96 61.34,68.58 | v47.12,59.44 v47.12,56.96 | v76.2,76.2 61.34,76.2
  Bottom 0.406: v51.56,20.32 54.23,17.65 66.55,17.65 70.61,21.72 v81.15,21.72 | v60.45,79.63 61.34,78.74 61.34,76.2 61.34,73.53 61.34,72.39 61.34,68.58 61.34,64.64 61.34,58.29 62.67,56.96 v69.03,56.96 | v69.03,56.96 69.09,56.9 | 69.09,56.9 69.09,55.88 | 69.09,55.88 69.09,49.4 69.09,44.32 v69.22,44.2 | v69.03,56.96 69.09,56.9 | 69.09,56.9 69.09,55.88
ACCEL3V3  (via drill 0.6)
  Top 0.254: v11.43,6.35 7.87,6.35 6.99,7.24 U17.P$7 | U10.1 11.73,18.92 12.57,18.92 13.46,18.03 v13.46,16.76
  Top 0.406: U15.2 37.08,32.51 33.66,29.08 v33.15,29.08
  Bottom 0.406: v33.15,29.08 33.15,22.1 32.51,21.46 28.96,21.46 24.26,16.76 | 24.26,16.76 19.3,11.81 16.89,11.81 v11.43,6.35 | v13.46,16.76 24.26,16.76
ACCEL5V
  Top 0.406: U15.3 38.35,32.26 31.5,25.4 U12.A8
FLUOR_ON_OFF
  Top 0.406: U12.28 R15.1
FLUOR_X10
  Top 0.406: R13.1 11.3,67.06 U12.24
FLUOR_X100
  Top 0.406: U12.26 11.81,65.02 R14.1
GND  (via drill 0.6)
  Top 0.254: C27.2 35.31,99.82 35.18,99.69 | C2.2 14.69,76.2 17.78,76.2 | v23.62,83.19 23.11,82.68 23.11,82.04 U25.4 23.11,78.74 22.35,77.98 19.3,77.98 19.3,76.2 U24.2 | 42.93,80.01 43.18,79.76 43.18,76.71 42.93,76.45 | U7.3 46.99,98.55 | C8.2 41.49,85.13 41.53,85.09 41.66,84.96 41.66,81.79
  Top 0.406: U17.P$5 5.84,9.13 5.84,9.14 | C27.2 v35.18,99.82 34.54,99.82 | 53.34,99.06 53.47,99.19 | 35.05,80.26 35.09,80.22 38.31,80.22 38.35,80.26 42.67,80.26 42.93,80.01
  Bottom 0.254: v35.18,99.82 35.18,98.68 35.31,98.55 | 35.05,81.28 32.51,81.28 | 35.05,80.01 35.27,80.22 35.56,80.22
  Bottom 0.406: 56.52,97.16 57.78,97.16 | 35.05,81.28 35.05,80.52 35.05,80.01 35.05,77.22 35.31,76.96 36.58,76.96 37.34,76.2 38.1,76.2
  other vias: 102.11,58.8 84.07,17.02 74.04,6.35 43.18,18.41 8.89,4.57 79.12,83.06 31.62,19.81 11.56,8.89 3.81,9.53 52.7,88.52 60.07,99.44 1.52,77.98 59.82,90.42 14.1,69.98 38.48,76.2 2.79,98.04 39.37,61.21 44.83,68.2 65.53,59.56 42.67,96.52 42.04,76.07 37.34,19.68
  pour Bottom (isolate 0.305): -0.51,73.53 16.89,73.53 16.89,86.11 20.07,86.11 20.07,102.62 33.4,102.62 33.4,74.04 51.69,74.04 51.69,80.9 64.39,80.9 64.39,88.01 57.66,88.01 57.66,102.62 113.41,102.49 113.41,-1.27 -1.27,-1.27
  pour Bottom (isolate 0.305): -0.38,101.47 18.8,101.47 18.8,87.38 16,87.38 16,74.55 -0.38,74.55
  pour Bottom (isolate 0.305): 34.29,101.85 34.29,75.18 50.8,75.18 50.8,81.66 63.5,81.66 63.5,87.25 56.77,87.25 56.77,101.85
  pour Top (isolate 0.305): -0.38,101.47 18.8,101.47 18.8,87.38 16,87.38 16,74.55 -0.38,74.55
  pour Top (isolate 0.305): -0.51,73.53 16.89,73.53 16.89,86.11 20.07,86.11 20.07,102.62 33.4,102.62 33.4,74.04 51.69,74.04 51.69,80.9 64.39,80.9 64.39,88.01 57.66,88.01 57.66,102.62 113.41,102.49 113.41,-1.27 -1.27,-1.27
  pour Top (isolate 0.305): 34.29,101.85 34.29,75.18 50.8,75.18 50.8,81.66 63.5,81.66 63.5,87.25 56.77,87.25 56.77,101.85
GPS_RX_3V3  (via drill 0.6)
  Top 0.254: U26.7 58.01,63.35 58.17,63.5 58.67,64.01 66.93,64.01 67.94,65.02 68.45,65.02 69.85,66.42 69.85,76.07 70.74,76.96 v70.74,83.19 | v77.47,85.47 80.87,85.47 U9.P$10
  Bottom 0.254: v70.74,83.19 74.42,83.19 76.71,85.47 v77.47,85.47
GPS_RXD
  Top 0.254: U26.11 48.06,62.69 47.12,63.63 43.56,63.63 42.16,65.02 41.02,65.02 U12.15
GPS_TX_3V3
  Top 0.254: 80.85,87 U9.P$9 76.41,86.95 72.39,82.93 72.39,81.28 72.39,65.66 71.12,64.39 68.2,64.39 67.18,63.37 58.93,63.37 58.29,62.74 56.31,62.74 U26.6
GPS_TXD
  Top 0.254: U26.10 48.41,63.35 47.5,64.26 44.32,64.26 U12.14
GPSON
  Top 0.406: U12.9 R21.1
IRIDIUM_RXD
  Top 0.254: U26.16 50.42,58.42 50.04,58.04 42.67,58.04 41.27,59.44 36.45,59.44 U12.19
IRIDIUM_RXD_3V3
  Top 0.254: U26.1 57.91,57.78 58.67,57.78 66.55,57.78 69.72,60.96 78.74,60.96 81.28,63.5 88.9,63.5 93.98,68.58 99.06,68.58 106.3,75.82 JP8.1
IRIDIUM_TXD
  Top 0.254: U26.14 47.07,60.76 46.1,61.72 42.55,61.72 41.27,62.99 35.43,62.99 U12.18
IRIDIUM_TXD_3V3
  Top 0.254: U26.3 59.11,60.76 59.18,60.83 59.69,61.34 68.33,61.34 69.09,62.1 78.74,62.1 80.77,64.14 88.39,64.14 93.47,69.22 93.73,69.47 93.98,69.72 99.06,69.72 101.73,72.39 104.78,75.44 104.78,78.87 104.78,83.69 105.15,84.06 JP8.6
IRIDIUMONOFF  (via drill 0.6)
  Top 0.254: v81.66,61.72 R25.1
  Bottom 0.254: U12.11 71.12,68.58 71.12,66.04 73.66,63.5 75.44,61.72 v81.66,61.72
IRIDIUMPOWER  (via drill 0.6)
  Top 0.406: v71.88,58.93 R23.1
  Bottom 0.406: v71.88,58.93 68.58,62.23 68.58,68.96 67.44,70.1 64.52,70.1 63.5,71.12 U12.8
MISO  (via drill 0.6)
  Top 0.406: U14.4 55.75,18.92 56.52,19.68 56.52,30.86 v51.94,35.43 | MISO5V.1 102.74,44.58 95.63,51.69 U12.MISO
  Bottom 0.406: v51.94,35.43 51.94,44.83 45.09,51.69 U12.MISO
MISO3V3  (via drill 0.6)
  Top 0.406: U17.P$12 11.88,11.49 MISO3V3.1 16,11.3 17.4,9.91 17.56,9.74 U16.7 17.56,5.04 v17.91,4.7 | v53.34,4.83 U20.19 | U14.2 v53.72,14.35
  Bottom 0.406: v17.91,4.7 23.24,4.7 27.3,8.76 35.69,8.76 39.62,4.83 v53.34,4.83 53.34,5.46 54.23,6.35 54.23,13.84 v53.72,14.35
MOSI
  Top 0.406: U12.MOSI 38.1,49.15 | 38.1,49.15 37.85,49.15 36.96,48.26 36.96,46.23 38.48,44.7 41.27,44.7 42.16,43.81 U15.11 | MOSI5V.1 101.22,49.28 97.03,53.47 91.19,53.47 37.34,53.47 36.7,52.83 36.7,50.55 38.1,49.15
MOSI3V3  (via drill 0.6)
  Top 0.254: U10.2 11.05,20.95 11.43,21.34 11.43,22.86
  Top 0.406: U15.12 40.89,41.4 40.13,42.16 35.43,42.16 29.59,36.32 29.59,28.83 26.54,25.78 13.59,25.78 13.08,25.78 11.43,24.13 11.43,22.86 | v51.94,7.37 U20.17 | 11.43,22.86 11.43,22.23 | 21.46,11.56 21.58,11.44 21.85,11.44 23.24,12.83 v30.61,12.83 30.61,15.75 MOSI3V3.1 | 21.46,11.56 12.7,20.32 12.06,20.95 11.43,21.59 11.43,22.86 | U16.3 21.94,11.08 21.46,11.56
  Bottom 0.406: v30.61,12.83 34.67,12.83 40.13,7.37 v51.94,7.37
N$1
  Top 0.406: 73.23,11.3 U19.4 73.23,11.3 | D2.A 73.23,11.3
N$2
  Top 0.406: R24.1 84.09,58.89 Q3.1 | 80.94,58.8 R24.1 | R23.2 80.99,58.93 R24.1
N$3  (via drill 0.6)
  Top 0.406: U19.5 73.18,15.18 | 73.18,15.18 R28.1 | R29.2 v77.34,7.49 | 73.18,15.18 75.57,15.18 ALARM.1
  Bottom 0.406: v77.34,7.49 77.34,13.4 ALARM.1
N$4  (via drill 0.6)
  Top 0.254: R25.2 97.37,67.06 v101.6,67.06 | JP8.7 103.35,85.31 102.87,84.84 v100.33,84.84
  Bottom 0.254: v101.6,67.06 104.27,69.72 104.27,79.38 100.33,83.31 v100.33,84.84
N$5
  Top 0.406: C7.1 37.58,78.56 U4.1
N$6
  Top 0.406: U12.5V D1.1 67.09,29.12 C13.1
N$7
  Top 0.254: U7.2 47.49,97.15 47.62,97.28 47.75,97.41 50.67,97.41 52.3,97.41 JP4.P$1
N$9
  Top 0.254: Q3.3 96.01,57.91 104.14,66.04 104.14,71.88 104.14,72.14 104.78,72.77 105.16,73.15 110.87,73.15 111.38,73.66 111.38,83.69 108.58,86.49 108.51,86.56 JP8.8
N$10
  Top 0.406: U9.P$11 95.91,85.47 97.16,85.47 97.79,86.11 97.79,89.15 99.31,90.68 101.22,90.68 102.23,91.69 102.23,92.58 JP5.1
N$11
  Top 0.406: U4.6 U4.7 39.75,84.96 39.88,85.09 39.88,85.89 C8.1 37.21,85.98 | 37.21,85.98 36.45,85.98 36.2,86.23 U6.5 | +3VT*.1 36.7,85.09 37.21,85.98
N$12
  Top 0.406: U23.6 46.61,80.9 46.74,80.77 46.74,80.16 R6.2 47.37,79.53 R4.1
N$13
  Top 0.406: U22.7 U22.8 45.34,88.09 U23.4
N$14
  Top 0.406: B1.+$1 60.13,95.81 61.59,97.28 75.06,97.28 76.58,95.76 76.58,93.65 B1.+$2 | 76.33,94.87 76.33,93.15 B1.+$2 | B1.+$2 77.38,94.45 U9.P$4
N$15
  Top 0.406: R21.2 66.04,80.1 R22.1 66.08,82.75 Q6.1
N$16
  Top 0.406: U20.16 53.22,8.64 B2.+$1 51.44,13.2 44.2,20.57 42.16,20.57 35.05,13.34 35.05,10.42 B2.+$2
N$17
  Top 0.406: R28.2 69.85,15.49 68.71,14.35 68.71,11.94 | 68.71,11.94 68.71,9.53 67.82,8.64 U20.5 | U19.2 68.96,12.19 68.71,11.94
N$18
  Top 0.406: U22.4 37.21,96.52 | 37.21,96.52 U22.5 | R33.2 37.21,95.97 37.21,96.52
N$19  (via drill 0.6)
  Top 0.406: v78.36,96.77 78.36,98.64 C11.1 78.08,98.95 U9.P$1 | Q6.3 70.57,85.05 72.73,85.05 v77.34,89.66
  Bottom 0.406: v78.36,96.77 78.61,96.52 78.61,90.93 v77.34,89.66
N$20
  Top 0.254: U24.1 18.01,77.7 19.05,78.74 22.1,78.74 22.35,78.99 22.35,82.8 22.35,83.82 22.86,84.33 27.89,84.33 JP7.P$3
N$21  (via drill 0.6)
  Top 0.254: R13.2 21.34,67.06 v22.1,67.82 | v25.4,81.28 24.38,81.28 24.13,81.03 U25.2
  Bottom 0.254: v22.1,67.82 22.61,68.33 22.61,80.01 23.88,81.28 v25.4,81.28
N$22  (via drill 0.6)
  Top 0.254: U25.7 24.13,77.72 24.38,77.98 25.15,77.98 25.65,77.47 25.65,76.71 v26.67,75.69
  Bottom 0.254: v26.67,75.69 28.7,75.69 29.46,76.45 29.46,78.99 29.46,79.8 JP7.P$5
N$23
  Top 0.406: C4.1 12.83,87.29 U1.7 U1.6 | C4.1 12.87,84.71 R2.2 12.74,84.58 10.79,84.58 8.71,82.5 U3.5 | U2.5 4.06,97.16 3.43,96.52 3.43,94.45 | 3.43,94.45 C5.2 | C4.1 12.61,87.5 12.48,87.38 +3VP*.1 6.86,87.38 6.22,88.01 6.22,89.79 4.45,91.57 4.45,91.69 3.43,92.71 3.43,94.45
N$24
  Top 0.406: C3.1 14.13,95.47 U1.1
N$25  (via drill 0.6)
  Top 0.406: U3.1 7.37,76.68 | 7.37,76.68 6.29,76.68 C1.2 R1.2 | 7.37,76.68 7.49,76.81 7.49,84.71 v8,85.22 | U2.1 7.9,92.2 VPAR.1
  Bottom 0.406: v8,85.22 8,92.08 VPAR.1
N$26
  Top 0.254: U7.4 46.49,97.49 R12.2
N$28
  Top 0.406: R2.1 12.83,80.05 R3.2 C2.1 10.95,76.33 U3.3
N$29
  Top 0.254: U25.3 23.62,81.53 23.62,81.79 23.88,82.04 24.38,82.04 24.89,82.55 25.15,82.8 29.46,82.8 JP7.P$6
N$30  (via drill 0.6)
  Top 0.406: U3.4 10.59,81.23 v10.54,81.28 | R1.1 C1.1 5.84,82.3 3.68,84.45 JP1.P$1
  Bottom 0.406: v10.54,81.28 5.84,81.28 5.84,82.3 4.7,83.44 3.68,84.45 JP1.P$1
N$31
  Top 0.406: U21.4 84.28,5.79 C22.1 R26.1 83.53,10.96 83.19,11.3 81.53,11.3 81.24,11.6 | 81.24,11.6 81.24,13.36 D3.C 81.22,13.61 SHTDN.1 | D2.C 80.95,11.3 81.24,11.6
N$32
  Top 0.406: R17.2 58.62,77.18 R19.1 58.57,77.79 Q5.1
N$33
  Top 0.406: 28.66,56.77 R20.1 | R20.1 31.31,56.73 Q4.1 | R18.2 28.7,56.77 R20.1
N$34  (via drill 0.6)
  Top 0.254: v23.62,75.18 U25.6
  Top 0.406: R14.2 v21.72,65.02
  Bottom 0.254: v23.62,75.18 23.62,74.42 24.13,73.91 25.15,72.9 25.15,72.77 25.15,66.29 23.88,65.02 v21.72,65.02
N$35
  Top 0.406: U10.4 8.09,14.56 U17.P$13
N$36  (via drill 0.6)
  Top 0.254: U7.8 v46.99,89.41
  Top 0.406: R6.1 43.81,80.24 v43.81,82.3 | 38.48,99.78 C27.1 | 38.48,99.78 C27.1 | 38.48,99.78 42,99.78 v42.04,99.82 41.02,98.81 U22.1 | U22.3 38.48,99.78 | 38.48,99.78 C27.1
  Bottom 0.254: v46.99,89.41 46.99,88.9
  Bottom 0.406: v43.81,82.3 43.81,83.19 46.99,86.36 46.99,88.9 v46.99,89.41 46.99,99.06 46.86,99.19 46.23,99.82 v42.04,99.82
N$37
  Top 0.406: Q7.1 18.82,61.66 R16.1 16.13,61.81 R15.2
N$38
  Top 0.254: U24.6 23.04,77.14 | 23.04,77.14 U25.5 | 23.04,77.14 23.11,77.22 23.11,77.98 23.62,78.49 24.13,78.49 24.64,78.99 U25.1 24.79,79.76 27.69,79.76 29.46,79.76 JP7.P$4
N$39
  Top 0.254: Q8.1 76.55,80.58 R31.1 R30.2
N$40  (via drill 0.6)
  Top 0.254: 25.4,60.88 Q7.3
  Top 0.406: 25.4,60.88 v25.4,63.5
  Bottom 0.254: JP7.P$1 27.38,77.72 27.26,77.6 26.16,77.6 25.15,76.58 25.15,74.8 25.65,74.3 26.92,74.3 27.69,73.53 27.69,66.04 27.69,65.79 v25.4,63.5
N$41
  Top 0.254: Q8.3 81.53,79.63 84.71,82.8 97.16,82.8 99.34,80.61 JP9.P$1
N$42
  Top 0.254: U6.1 37.13,90.63 36.83,90.93 36.7,91.06 36.45,91.06 36.32,91.19 36.32,93.51 R33.1
N$43
  Top 0.254: R32.2 89.45,75.02 87.38,77.09 87.38,79.47 JP9.P$5
N$44
  Top 0.406: D3.A 79.04,16.68 R27.2
N$45
  Top 0.254: U7.9 47.5,93.09 47.88,93.47 48.01,93.47 48.13,93.47 50.8,90.81 50.8,87.4 53.36,84.84 JP3.P$2
N$47
  Top 0.254: U7.7 46.48,91.44 46.1,91.06 45.85,91.06 44.62,91.06 R34.1
RTC3V3  (via drill 0.6)
  Top 0.406: v43.43,28.19 42.16,29.46 U15.6 | U20.1 64.52,3.56 64.01,4.06 64.01,18.41 v61.47,20.95
  Bottom 0.406: v43.43,28.19 45.85,25.78 54.86,25.78 56.26,24.38 56.26,21.59 56.9,20.95 v61.47,20.95
RTC5V
  Top 0.406: U12.A2 49.28,26.67 43.43,32.51 U15.7
SCK  (via drill 0.6)
  Top 0.406: v46.74,39.37 44.76,39.37 U15.9 | SCK5V.1 105.28,39.75 95.89,49.15 56.9,49.15 U12.SCK
  Bottom 0.406: U12.SCK 43.81,49.15 46.61,46.35 46.61,39.5 v46.74,39.37
SCK3V3
  Top 0.406: 35.56,2.92 19.68,2.92 19.65,2.95 19.3,2.95 | 35.56,2.92 56.34,2.92 U20.20 58.67,3.56 59.05,3.94 59.05,5.71 58.67,6.1 U20.18 60.58,6.1 62.1,7.62 62.1,17.78 57.78,22.1 57.78,32.51 48.51,41.78 44.2,41.78 43.43,41.02 U15.10 | 19.3,2.95 3.52,2.95 1.91,4.57 1.91,11.3 1.91,12.95 3.94,14.99 5.59,14.99 6.99,13.59 U17.P$14 | U16.5 19.79,3.44 19.3,2.95 | SCK3V3.1 34.54,3.94 35.56,2.92
SCL3V3  (via drill 0.6)
  Top 0.406: U2.3 8.87,99.06 22.86,99.06 24.54,97.39 JP2.P$3 | SCL3V3.1 24.64,93.34 R7.1 29.28,93.32 Q1.2 28.91,91.4 v27.43,89.92 | v35.05,92.46 35.26,92.25 U6.3
  Bottom 0.406: SCL3V3.1 24.51,97 JP2.P$3 | v27.43,89.92 32.51,89.92 v35.05,92.46
SCL5V  (via drill 0.6)
  Top 0.406: Q1.3 29.76,89.2 v28.45,87.88 | SCL5V.1 R9.1 | U12.21 18.01,72.8 U24.3
  Bottom 0.406: v28.45,87.88 25.91,87.88 24.64,89.15 20.57,89.15 18.03,86.61 SCL5V.1 18.03,72.77 U12.21
SDA3V3  (via drill 0.6)
  Top 0.406: 4.9,98.09 U2.4 5.31,98.65 v6.86,100.2 | SDA3V3.1 20.57,93.22 19.56,92.2 19.56,89.15 20.07,88.65 20.92,88.65 R5.1 23.26,88.69 Q2.2 23.37,88.63 v23.37,87.12 | U6.4 35.26,86.18 v34.8,85.72
  Bottom 0.406: v6.86,100.2 18.36,100.2 JP2.P$4 21.08,96.58 SDA3V3.1 | v23.37,87.12 24.64,85.85 29.97,85.85 34.29,85.85 34.42,85.72 v34.8,85.72
SDA5V
  Top 0.406: Q2.3 25.48,86.44 24.89,85.85 23.11,85.85 22.35,85.85 21.84,85.34 21.84,84.33 21.34,83.82 20.66,83.82 | 20.66,83.82 R11.1 | 20.66,83.82 R11.1 | R11.1 20.57,80.52 SDA5V.1 | U12.20 20.6,72.75 U24.4
  Bottom 0.406: SDA5V.1 20.83,72.52 U12.20
SDCARD3V3
  Top 0.406: U15.4 39.62,31.37 34.42,26.16 34.42,20.83 34.42,15.88 32.38,13.84 32.38,12.06 31.11,10.79 23.24,10.79 22.99,10.55 U16.2
SDCARD5V
  Top 0.406: U12.A5 41.66,25.02 40.89,25.78 U15.5
SERIAL_COMM_ON
  Top 0.254: U12.2 46.74,70.1 46.74,69.09 48.13,67.69 U8.2
SERIAL_COMM_ON_3V3
  Top 0.254: U26.8 56.3,64.05 R8.2 52.32,65.66 51.56,66.42 U8.4
SHTDN  (via drill 0.6)
  Top 0.406: R27.1 74.72,19.3 v65.41,19.3
  Bottom 0.406: U12.A0 54.36,21.72 56.77,19.3 v65.41,19.3
TEMP1  (via drill 0.6)
  Top 0.254: v49.15,89.28 47.99,90.44 U7.10
  Bottom 0.406: U12.3 49.28,89.15 v49.15,89.28
TEMP2  (via drill 0.6)
  Top 0.254: v49.4,95.89 48.81,96.47 U7.1
  Bottom 0.406: U12.4 51.82,73.15 50.8,74.17 50.8,94.49 v49.4,95.89
UCAM_POWER
  Top 0.254: U12.12 R30.1
UCAM_RESET
  Top 0.254: U12.13 76.2,70.23 76.83,69.6 89.15,69.6 90.3,70.74 R32.1
UCAM_RX_3V3
  Top 0.254: U26.5 58.5,62.05 59.18,62.74 67.56,62.74 68.58,63.75 77.98,63.75 80.01,65.79 87.76,65.79 93.34,71.37 JP9.P$3
UCAM_RXD
  Top 0.254: U26.13 47.32,61.39 46.74,61.98 46.35,62.36 43.31,62.36 42.8,62.36 41.78,63.37 41.53,63.63 35.94,63.63 28.96,70.61 U12.17
UCAM_TX_3V3
  Top 0.254: U26.4 58.85,61.39 59.44,61.98 67.94,61.98 68.96,62.99 78.36,62.99 80.39,65.02 88.27,65.02 96.27,73.03 96.34,73.1 JP9.P$2
UCAM_TXD
  Top 0.254: U26.12 47.68,62.05 46.74,62.99 43.18,62.99 41.78,64.39 39.12,64.39 U12.16
VBATT
  Top 0.406: VBATT.1 108.43,8.74 JP6.P$1 104.93,8.64 104.39,8.64 101.85,6.1 101.85,2.67 100.71,1.52 90.14,1.52 U21.5 84.11,4.09 C18.1 83.82,2.54 83.06,1.78 78.23,1.78 77.34,2.67 R29.1
VCC/2  (via drill 0.6)
  Top 0.254: U24.5 21.34,76.2 22.1,75.44 | 22.1,75.18 22.1,75.44 | 22.1,75.44 22.1,74.42 22.61,73.91 | 22.61,73.91 25.15,73.91 | 25.15,73.91 26.92,73.91 27.43,74.42 27.94,74.93 29.72,76.71 30.48,76.71 | 25.15,76.56 25.15,76.45 | 25.15,76.45 25.15,73.91 | v21.34,87.12 20.57,86.36 R11.2 | 25.15,76.56 U25.8 25.15,76.56 | 25.15,76.56 25.15,76.45 | 25.15,76.45 25.15,73.91 | 25.15,73.91 22.61,73.91 | 22.61,73.91 22.61,70.74 21.72,69.85 20.45,69.85 17.4,69.85 16.38,70.87 v16,71.25
  Top 0.406: U1.2 v12.83,97.54 | 40.64,74.04 40.26,74.42 39.75,74.93 U4.2 | U22.6 38.48,91.19 39.12,90.55 41.15,90.55 41.53,90.17 42.04,89.66 C26.1 42.16,88.65 43.18,87.63 44.07,86.74 44.07,85.6 44.58,85.09 46.48,83.19 49.91,83.19 50.04,83.06 50.16,82.93 50.29,82.8 50.29,81.53 50.67,81.15 50.8,81.03 51.69,81.03 53.26,79.46 Q5.3 53.26,77.51 52.43,76.68 52.32,76.68 | 52.32,76.68 R4.2 49.76,76.71 C25.1 | v15.49,85.09 15.84,85.43 R9.2 R11.2 | 30.48,76.71 33.78,76.71 36.58,73.91 40.51,73.91 40.64,74.04 | 40.64,74.04 51.82,74.04 52.32,74.55 52.32,76.68
  Bottom 0.254: 26.42,79.8 26.42,81.79 26.42,82.04 26.16,82.3 22.35,82.3 21.34,83.31 v21.34,87.12 | v16,71.25 16,84.58 v15.49,85.09
  Bottom 0.406: v12.83,97.54 12.83,86.36 14.1,85.09 v15.49,85.09
VDD  (via drill 0.6)
  Top 0.254: U7.5 45.99,95.52 45.97,95.5 45.21,94.74 | 45.21,94.74 C9.1 | U7.6 45.99,93.96 45.21,94.74
  Top 0.406: 33.27,55.63 33.23,55.67 Q4.3 34.76,57.02 v36.53,57.02 | R5.2 21.18,90.61 Q2.1 24.11,91.44 25.65,91.44 26.16,91.44 v26.67,91.95 | JP2.P$1 30.95,96.61 R7.2 | R7.2 31.18,93.12 Q1.1 33.53,89.05 33.53,78.74 | v32.77,93.22 31.08,93.22 R7.2 | 33.53,78.74 v33.53,78.49 33.53,78.74 | C9.1 44.41,96.69 v44.32,96.77
  Bottom 0.406: JP2.P$1 31.42,97.92 37.47,97.92 42.42,97.92 42.67,97.92 44.07,97.92 44.32,97.66 v44.32,96.77 | v26.67,91.95 31.5,91.95 v32.77,93.22 | v33.53,78.49 33.53,76.96 36.83,73.66 38.1,73.66 39.07,72.69 39.07,69.55 38.1,68.58 36.53,67.01 v36.53,57.02

### Text on the board
tValues: - | +